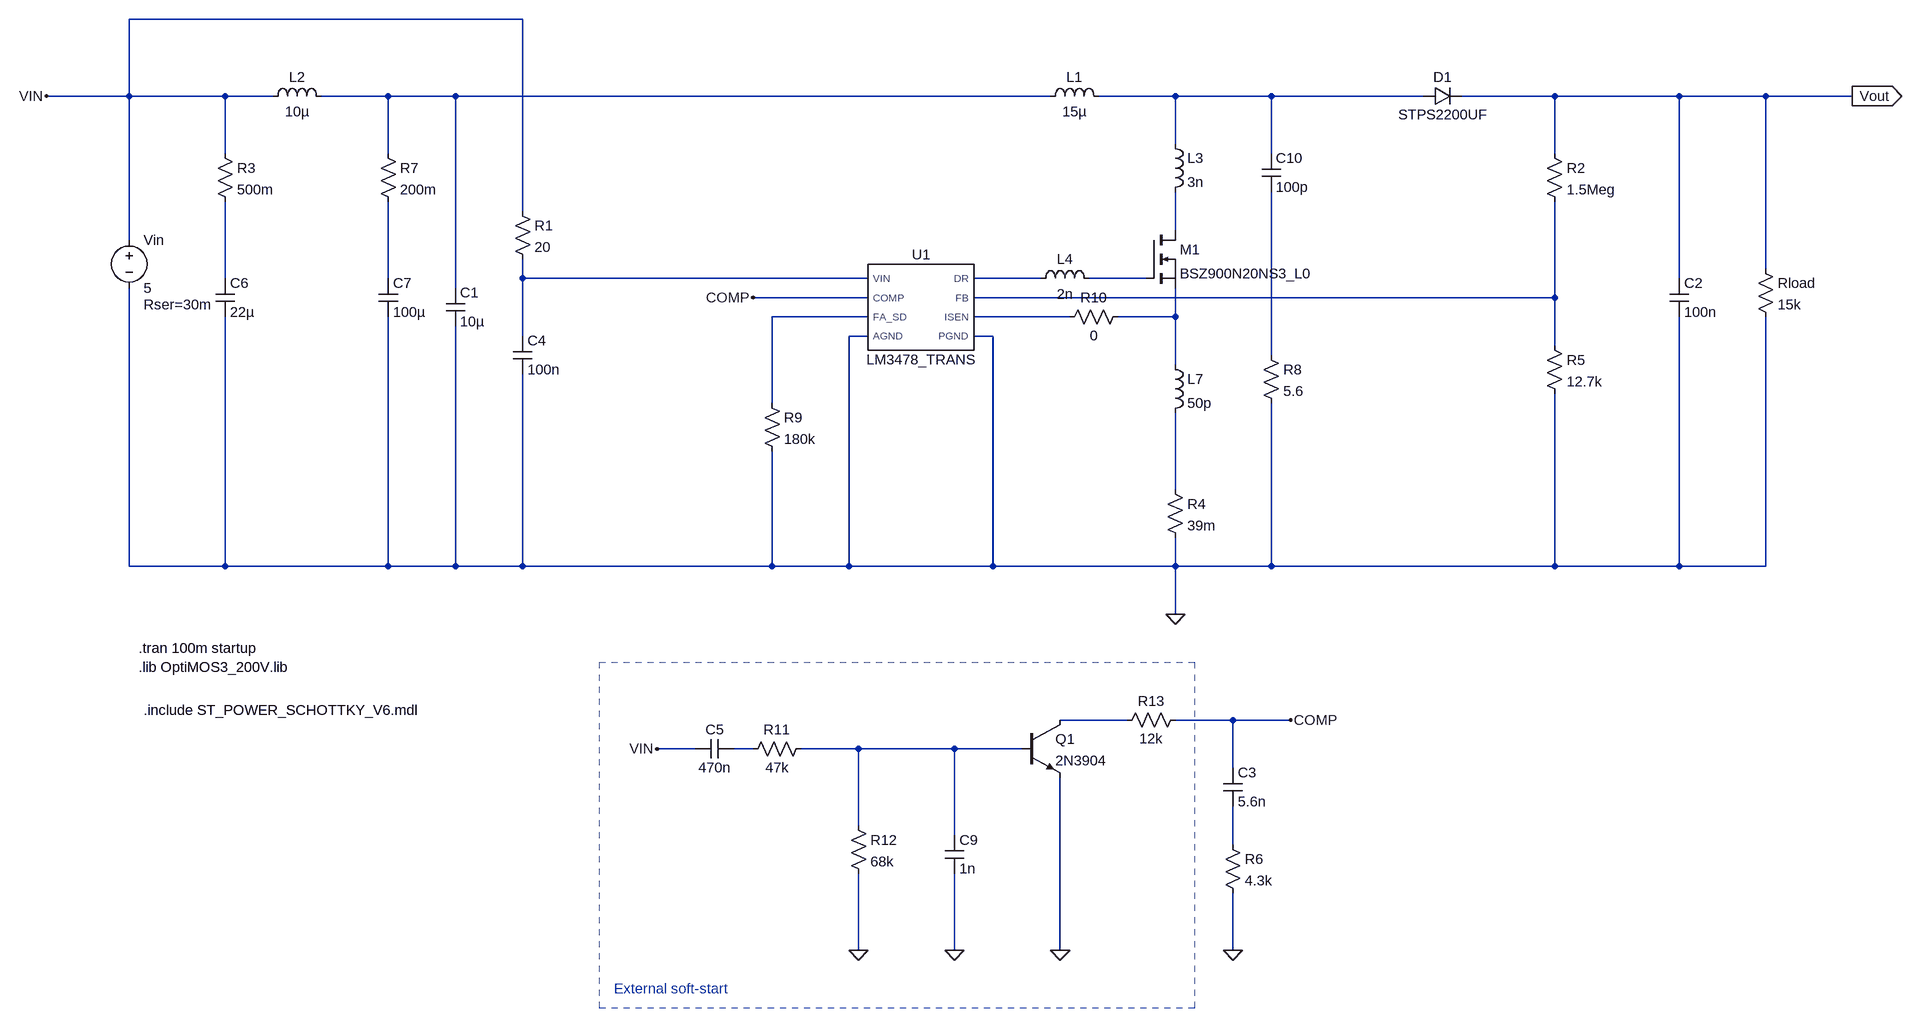
[diagram p0: schematic DCM CPM LM3478.asc]
DCM CPM LM3478.asc, the LTspice schematic file:
Version 4
SHEET 1 2048 1588
WIRE -432 -272 -1088 -272
WIRE -1088 -144 -1088 -272
WIRE -1088 -144 -1264 -144
WIRE -928 -144 -1088 -144
WIRE -848 -144 -928 -144
WIRE -656 -144 -768 -144
WIRE -544 -144 -656 -144
WIRE 448 -144 -544 -144
WIRE 656 -144 528 -144
WIRE 816 -144 656 -144
WIRE 1088 -144 816 -144
WIRE 1440 -144 1152 -144
WIRE 1648 -144 1440 -144
WIRE 1792 -144 1648 -144
WIRE 1936 -144 1792 -144
WIRE 656 -64 656 -144
WIRE -928 -48 -928 -144
WIRE -656 -48 -656 -144
WIRE 816 -48 816 -144
WIRE 1440 -48 1440 -144
WIRE -432 48 -432 -272
WIRE 656 80 656 16
WIRE -1088 96 -1088 -144
WIRE 1792 144 1792 -144
WIRE -928 160 -928 32
WIRE -656 160 -656 32
WIRE -432 160 -432 128
WIRE 144 160 -432 160
WIRE 432 160 320 160
WIRE 608 160 512 160
WIRE 1648 160 1648 -144
WIRE -544 176 -544 -144
WIRE 144 192 -48 192
WIRE 1440 192 1440 32
WIRE 1440 192 320 192
WIRE 144 224 -16 224
WIRE 480 224 320 224
WIRE 656 224 656 176
WIRE 656 224 560 224
WIRE -432 256 -432 160
WIRE 144 256 112 256
WIRE 352 256 320 256
WIRE 1440 272 1440 192
WIRE 816 288 816 16
WIRE 656 304 656 224
WIRE -16 368 -16 224
WIRE 656 512 656 384
WIRE -1088 640 -1088 176
WIRE -928 640 -928 224
WIRE -928 640 -1088 640
WIRE -656 640 -656 224
WIRE -656 640 -928 640
WIRE -544 640 -544 240
WIRE -544 640 -656 640
WIRE -432 640 -432 320
WIRE -432 640 -544 640
WIRE -16 640 -16 448
WIRE -16 640 -432 640
WIRE 112 640 112 256
WIRE 112 640 -16 640
WIRE 352 640 352 256
WIRE 352 640 112 640
WIRE 656 640 656 592
WIRE 656 640 352 640
WIRE 816 640 816 368
WIRE 816 640 656 640
WIRE 1440 640 1440 352
WIRE 1440 640 816 640
WIRE 1648 640 1648 224
WIRE 1648 640 1440 640
WIRE 1792 640 1792 224
WIRE 1792 640 1648 640
WIRE 656 720 656 640
WIRE 576 896 464 896
WIRE 752 896 656 896
WIRE 848 896 752 896
WIRE -144 944 -208 944
WIRE -48 944 -80 944
WIRE 128 944 32 944
WIRE 288 944 128 944
WIRE 400 944 288 944
WIRE 752 976 752 896
WIRE 128 1072 128 944
WIRE 288 1088 288 944
WIRE 752 1104 752 1040
WIRE 128 1280 128 1152
WIRE 288 1280 288 1152
WIRE 464 1280 464 992
WIRE 752 1280 752 1184
FLAG 656 720 0
FLAG 1936 -144 Vout
IOPIN 1936 -144 Out
FLAG 128 1280 0
FLAG 288 1280 0
FLAG 464 1280 0
FLAG 848 896 COMP
FLAG -48 192 COMP
FLAG -1264 -144 VIN
FLAG -208 944 VIN
FLAG 752 1280 0
SYMBOL voltage -1088 80 R0
WINDOW 123 0 0 Left 2
WINDOW 39 24 124 Left 2
SYMATTR SpiceLine Rser=30m
SYMATTR InstName Vin
SYMATTR Value 5
SYMBOL ind 432 -128 R270
WINDOW 0 32 56 VTop 2
WINDOW 3 5 56 VBottom 2
SYMATTR InstName L1
SYMATTR Value 15µ
SYMATTR SpiceLine Rser=90m
SYMBOL cap -560 176 R0
SYMATTR InstName C1
SYMATTR Value 10µ
SYMBOL cap 1632 160 R0
SYMATTR InstName C2
SYMATTR Value 100n
SYMATTR SpiceLine Rser=20m
SYMBOL diode 1088 -128 R270
WINDOW 0 32 32 VTop 2
WINDOW 3 0 32 VBottom 2
SYMATTR InstName D1
SYMATTR Value STPS2200UF
SYMBOL LM3478_TRANS 224 208 R0
SYMATTR InstName U1
SYMBOL res -448 32 R0
SYMATTR InstName R1
SYMATTR Value 20
SYMBOL cap -448 256 R0
SYMATTR InstName C4
SYMATTR Value 100n
SYMBOL res -32 352 R0
SYMATTR InstName R9
SYMATTR Value 180k
SYMBOL res 640 496 R0
SYMATTR InstName R4
SYMATTR Value 39m
SYMBOL res 1424 -64 R0
SYMATTR InstName R2
SYMATTR Value 1.5Meg
SYMBOL res 1424 256 R0
SYMATTR InstName R5
SYMATTR Value 12.7k
SYMBOL cap 736 976 R0
SYMATTR InstName C3
SYMATTR Value 5.6n
SYMBOL res 736 1088 R0
SYMATTR InstName R6
SYMATTR Value 4.3k
SYMBOL res 1776 128 R0
SYMATTR InstName Rload
SYMATTR Value 15k
SYMBOL nmos 608 80 R0
SYMATTR InstName M1
SYMATTR Value BSZ900N20NS3_L0
SYMATTR Prefix X
SYMBOL ind -864 -128 R270
WINDOW 0 32 56 VTop 2
WINDOW 3 5 56 VBottom 2
SYMATTR InstName L2
SYMATTR Value 10µ
SYMATTR SpiceLine Rser=50m
SYMBOL res -944 -64 R0
SYMATTR InstName R3
SYMATTR Value 500m
SYMBOL res -672 -64 R0
SYMATTR InstName R7
SYMATTR Value 200m
SYMBOL cap -944 160 R0
SYMATTR InstName C6
SYMATTR Value 22µ
SYMATTR SpiceLine Rser=100m
SYMBOL cap -672 160 R0
SYMATTR InstName C7
SYMATTR Value 100µ
SYMATTR SpiceLine Rser=45m
SYMBOL cap 800 -48 R0
SYMATTR InstName C10
SYMATTR Value 100p
SYMBOL ind 640 -80 R0
SYMATTR InstName L3
SYMATTR Value 3n
SYMBOL ind 640 288 R0
SYMATTR InstName L7
SYMATTR Value 50p
SYMBOL res 800 272 R0
SYMATTR InstName R8
SYMATTR Value 5.6
SYMBOL ind 416 176 R270
WINDOW 0 32 56 VTop 2
WINDOW 3 5 56 VBottom 2
SYMATTR InstName L4
SYMATTR Value 2n
SYMBOL res 576 208 R90
WINDOW 0 0 56 VBottom 2
WINDOW 3 32 56 VTop 2
SYMATTR InstName R10
SYMATTR Value 0
SYMBOL cap -144 960 R270
WINDOW 0 32 32 VTop 2
WINDOW 3 0 32 VBottom 2
SYMATTR InstName C5
SYMATTR Value 470n
SYMBOL res 112 1056 R0
SYMATTR InstName R12
SYMATTR Value 68k
SYMBOL cap 272 1088 R0
SYMATTR InstName C9
SYMATTR Value 1n
SYMBOL npn 400 896 R0
SYMATTR InstName Q1
SYMATTR Value 2N3904
SYMBOL res -64 960 R270
WINDOW 0 32 56 VTop 2
WINDOW 3 0 56 VBottom 2
SYMATTR InstName R11
SYMATTR Value 47k
SYMBOL res 672 880 R90
WINDOW 0 0 56 VBottom 2
WINDOW 3 32 56 VTop 2
SYMATTR InstName R13
SYMATTR Value 12k
TEXT -1072 776 Left 2 !.tran 100m startup
TEXT -1064 880 Left 2 !.include ST_POWER_SCHOTTKY_V6.mdl
TEXT -1072 808 Left 2 !.lib OptiMOS3_200V.lib
TEXT -280 1344 Left 2 ;External soft-start
RECTANGLE Normal 688 1376 -304 800 1

The netlist it stands for:
* DCM CPM LM3478.asc
Vin VIN 0 5 Rser=30m
L1 N001 N002 15µ Rser=90m
C1 N001 0 10µ
C2 Vout 0 100n Rser=20m
D1 N002 Vout STPS2200UF
XU1 0 COMP N007 N010 N009 N011 0 N006 LM3478_TRANS  ; pins AGND COMP DR FA_SD FB ISEN PGND VIN
R1 VIN N006 20
C4 N006 0 100n
R9 N010 0 180k
R4 N014 0 39m
R2 Vout N009 1.5Meg
R5 N009 0 12.7k
C3 COMP N018 5.6n
R6 N018 0 4.3k
Rload Vout 0 15k
XM1 N003 N008 N012 BSZ900N20NS3_L0  ; pins D G S
L2 VIN N001 10µ Rser=50m
R3 VIN N004 500m
R7 N001 N005 200m
C6 N004 0 22µ Rser=100m
C7 N005 0 100µ Rser=45m
C10 N002 N013 100p
L3 N002 N003 3n
L7 N012 N014 50p
R8 N013 0 5.6
L4 N007 N008 2n
R10 N012 N011 0
C5 VIN N016 470n
R12 N017 0 68k
C9 N017 0 1n
Q1 N015 N017 0 0 2N3904
R11 N016 N017 47k
R13 COMP N015 12k
.model D D
.lib standard.dio
.model NPN NPN
.model PNP PNP
.lib standard.bjt
.tran 100m startup
.include ST_POWER_SCHOTTKY_V6.mdl
.lib OptiMOS3_200V.lib
* External soft-start
.lib LM3478_TRANS.ckt
.backanno
.end